# Altium schematic sheet 1-Notes.SchDoc: Notes
size B; CompanyName: NextGen RF Design; Address1: 2130 Howard Drive W; Address2: North Mankato, MN 56003; Address3: www.nextgenrf.com; Revision: 2; SheetNumber: 1; SheetTotal: 7; ProjName: BytePipe X9002_HDK
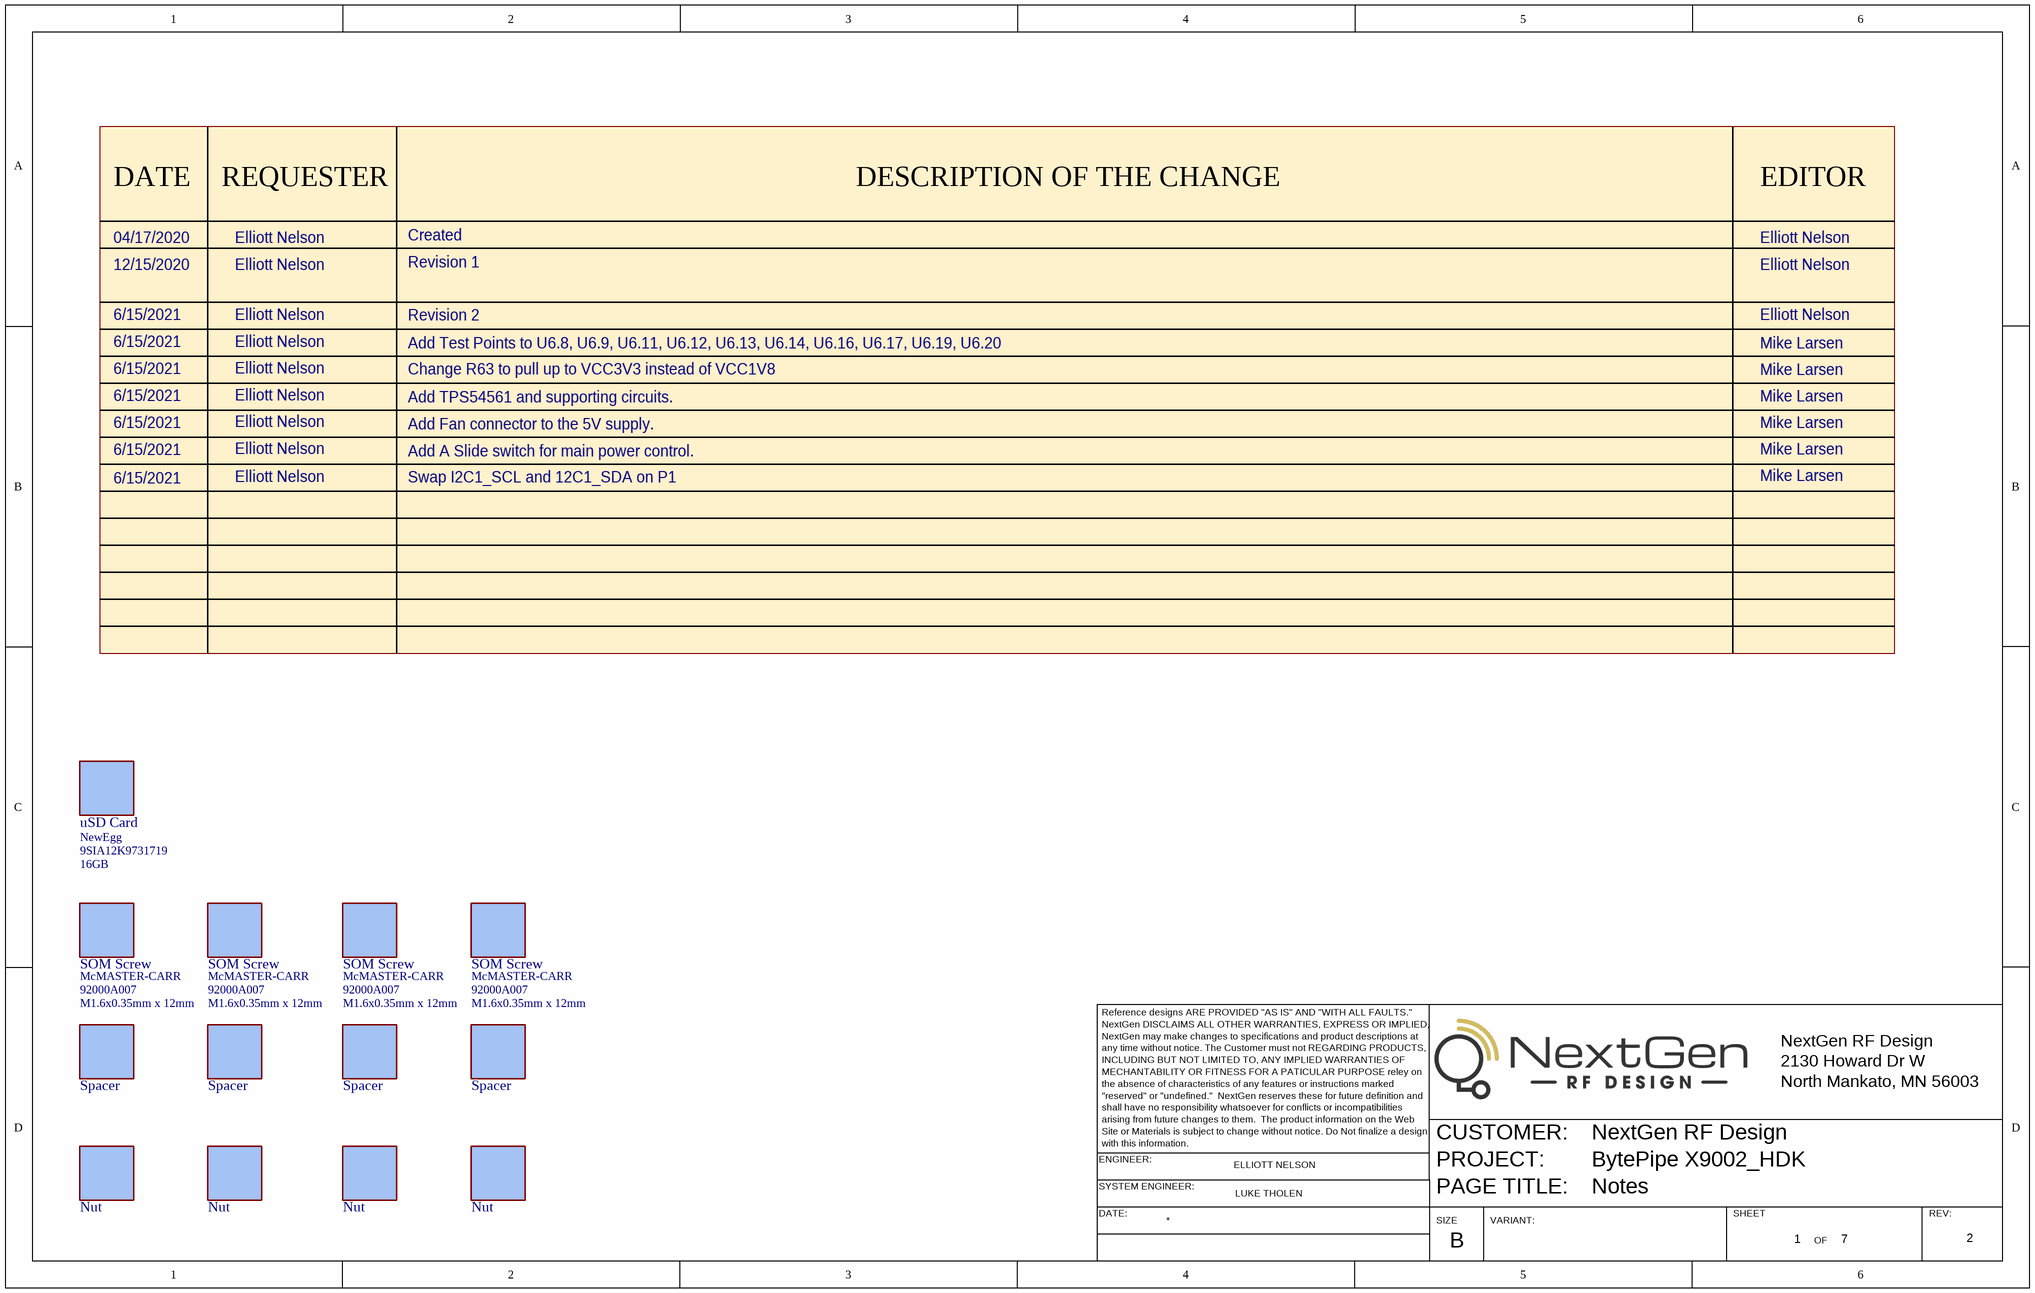
[diagram p0: 1-Notes.SchDoc]

## Parts
B1  uSD Card  value 16GB  OEM NAME: NewEgg  OEM#: 9SIA12K9731719
B2  SOM Screw  value M1.6x0.35mm x 12mm  OEM NAME: McMASTER-CARR  OEM#: 92000A007
B9  SOM Screw  value M1.6x0.35mm x 12mm  OEM NAME: McMASTER-CARR  OEM#: 92000A007
B10  SOM Screw  value M1.6x0.35mm x 12mm  OEM NAME: McMASTER-CARR  OEM#: 92000A007
B11  SOM Screw  value M1.6x0.35mm x 12mm  OEM NAME: McMASTER-CARR  OEM#: 92000A007
B12  Spacer
B13  Spacer
B14  Spacer
B15  Spacer
B20  Nut
B21  Nut
B22  Nut
B23  Nut

## Notes on the sheet
- DATE
- REQUESTER
- Created
- DESCRIPTION OF THE CHANGE
- EDITOR
- 04/17/2020
- 12/15/2020
- Elliott Nelson
- Revision 1
- 6/15/2021
- Add Test Points to U6.8, U6.9, U6.11, U6.12, U6.13, U6.14, U6.16, U6.17, U6.19, U6.20
- Change R63 to pull up to VCC3V3 instead of VCC1V8
- Revision 2
- Mike Larsen
- Add TPS54561 and supporting circuits.
- Add Fan connector to the 5V supply.
- Swap I2C1_SCL and 12C1_SDA on P1
- Add A Slide switch for main power control.
- Reference designs ARE PROVIDED "AS IS" AND "WITH ALL FAULTS."
- NextGen DISCLAIMS ALL OTHER WARRANTIES, EXPRESS OR IMPLIED,
- NextGen may make changes to specifications and product descriptions at
- NextGen RF Design
- any time without notice. The Customer must not REGARDING PRODUCTS,
- INCLUDING BUT NOT LIMITED TO, ANY IMPLIED WARRANTIES OF
- MECHANTABILITY OR FITNESS FOR A PATICULAR PURPOSE reley on
- "reserved" or "undefined."  NextGen reserves these for future definition and
- the absence of characteristics of any features or instructions marked
- shall have no responsibility whatsoever for conflicts or incompatibilities
- 2130 Howard Dr W
- North Mankato, MN 56003
- ENGINEER:
- Site or Materials is subject to change without notice. Do Not finalize a design
- with this information.
- arising from future changes to them.  The product information on the Web
- ELLIOTT NELSON
- CUSTOMER:
- PROJECT:
- SYSTEM ENGINEER:
- DATE:
- LUKE THOLEN
- SIZE
- PAGE TITLE:
- VARIANT:
- SHEET
- OF
- REV:
- B

## Library data of the parts
B1 = BOM_COMPONENT_NO-FOOTPRINT: 16GB Micro SD Memory Card Class 10 80MB/s Storage Device- BLACK
B2 B9-B15 B20-B23 = BOM_COMPONENT_NO-FOOTPRINT